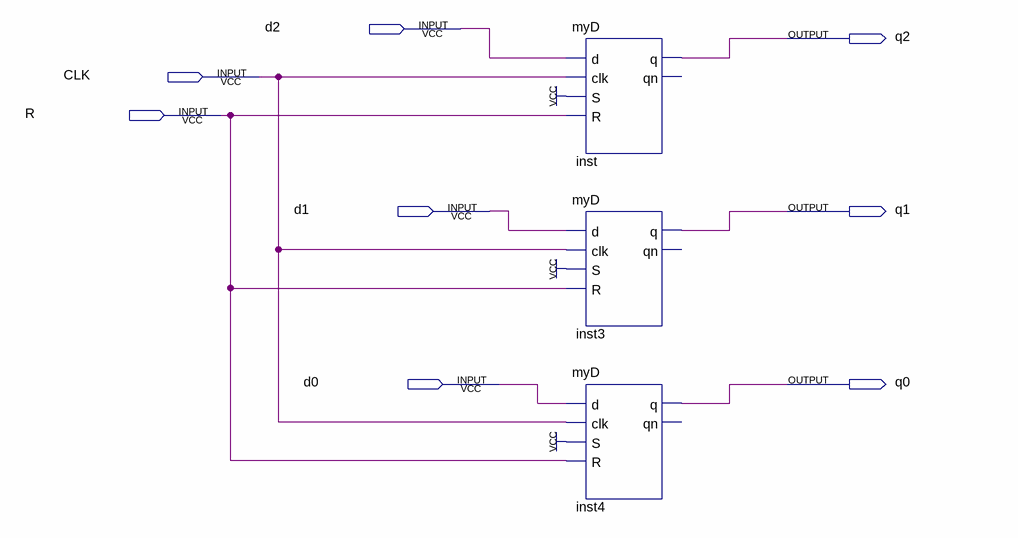
[diagram p0: schematic sheet]
// Quartus schematic exp2_2.bdf as structural Verilog: 3 symbols, 8 pins
module exp2_2 (
  input  d2,
  input  CLK,
  input  R,
  input  d1,
  input  d0,
  output q2,
  output q1,
  output q0
);

  myD inst (.d(d2), .clk(CLK), .S(1'b1), .R(R), .q(q2));  // open: qn
  myD inst3 (.d(d1), .clk(CLK), .S(1'b1), .R(R), .q(q1));  // open: qn
  myD inst4 (.d(d0), .clk(CLK), .S(1'b1), .R(R), .q(q0));  // open: qn
endmodule
